# EAGLE schematic reg-board (EAGLE 7.6.0)

## Sheet 1 of 5: Bus Buffering
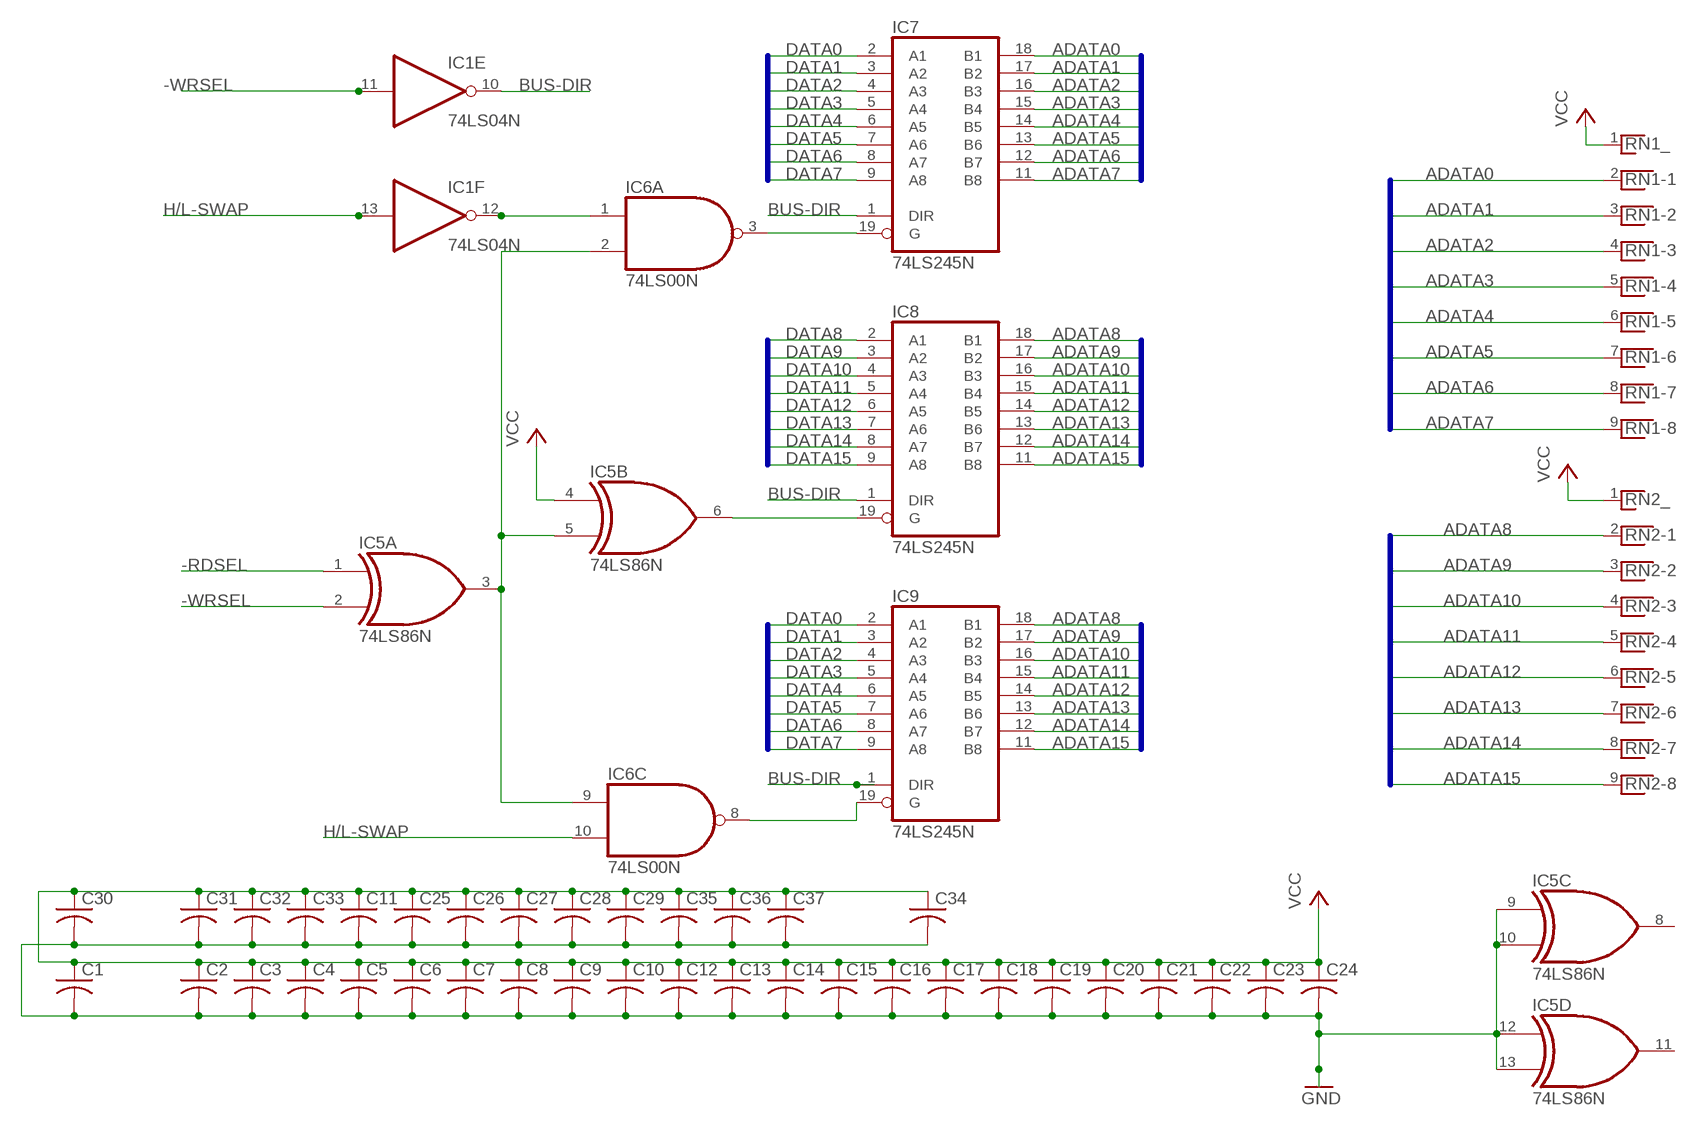
[diagram p0: schematic, sheet 1]

### Parts
C1  C-US025-040X050  [C025-040X050]
C2  C-US025-040X050  [C025-040X050]
C3  C-US025-040X050  [C025-040X050]
C4  C-US025-040X050  [C025-040X050]
C5  C-US025-040X050  [C025-040X050]
C6  C-US025-040X050  [C025-040X050]
C7  C-US025-040X050  [C025-040X050]
C8  C-US025-040X050  [C025-040X050]
C9  C-US025-040X050  [C025-040X050]
C10  C-US025-040X050  [C025-040X050]
C11  C-US025-040X050  [C025-040X050]
C12  C-US025-040X050  [C025-040X050]
C13  C-US025-040X050  [C025-040X050]
C14  C-US025-040X050  [C025-040X050]
C15  C-US025-040X050  [C025-040X050]
C16  C-US025-040X050  [C025-040X050]
C17  C-US025-040X050  [C025-040X050]
C18  C-US025-040X050  [C025-040X050]
C19  C-US025-040X050  [C025-040X050]
C20  C-US025-040X050  [C025-040X050]
C21  C-US025-040X050  [C025-040X050]
C22  C-US025-040X050  [C025-040X050]
C23  C-US025-040X050  [C025-040X050]
C24  C-US025-040X050  [C025-040X050]
C25  C-US025-040X050  [C025-040X050]
C26  C-US025-040X050  [C025-040X050]
C27  C-US025-040X050  [C025-040X050]
C28  C-US025-040X050  [C025-040X050]
C29  C-US025-040X050  [C025-040X050]
C30  C-US025-040X050  [C025-040X050]
C31  C-US025-040X050  [C025-040X050]
C32  C-US025-040X050  [C025-040X050]
C33  C-US025-040X050  [C025-040X050]
C34  C-US025-040X050  [C025-040X050]
C35  C-US025-040X050  [C025-040X050]
C36  C-US025-040X050  [C025-040X050]
C37  C-US025-040X050  [C025-040X050]
IC1  74LS04N  [DIL14]
IC5  74LS86N  [DIL14]
IC6  74LS00N  [DIL14]
IC7  74LS245N  [DIL20]
IC8  74LS245N  [DIL20]
IC9  74LS245N  [DIL20]
RN1  RNX8  [RN-9]
RN2  RNX8  [RN-9]

### Nets
-RDSEL: IC5.1(A:I0) ; also sheet 2
-WRSEL: IC1.11(E:I) IC5.2(A:I1) ; also sheet 2
ADATA0: IC7.18(B1) RN1.2 ; also sheet 2,3,4
ADATA1: IC7.17(B2) RN1.3 ; also sheet 2,3,4
ADATA2: IC7.16(B3) RN1.4 ; also sheet 2,3,4
ADATA3: IC7.15(B4) RN1.5 ; also sheet 2,3,4
ADATA4: IC7.14(B5) RN1.6 ; also sheet 2,3,4
ADATA5: IC7.13(B6) RN1.7 ; also sheet 2,3,4
ADATA6: IC7.12(B7) RN1.8 ; also sheet 2,3,4
ADATA7: IC7.11(B8) RN1.9 ; also sheet 2,3,4
ADATA8: IC8.18(B1) IC9.18(B1) RN2.2 ; also sheet 2,3,4
ADATA9: IC8.17(B2) IC9.17(B2) RN2.3 ; also sheet 2,3,4
ADATA10: IC8.16(B3) IC9.16(B3) RN2.4 ; also sheet 2,3,4
ADATA11: IC8.15(B4) IC9.15(B4) RN2.5 ; also sheet 2,3,4
ADATA12: IC8.14(B5) IC9.14(B5) RN2.6 ; also sheet 2,3,4
ADATA13: IC8.13(B6) IC9.13(B6) RN2.7 ; also sheet 2,3,4
ADATA14: IC8.12(B7) IC9.12(B7) RN2.8 ; also sheet 2,3,4
ADATA15: IC8.11(B8) IC9.11(B8) RN2.9 ; also sheet 2,3,4
BUS-DIR: IC1.10(E:O) IC7.1(DIR) IC8.1(DIR) IC9.1(DIR)
DATA0: IC7.2(A1) IC9.2(A1) ; also sheet 5
DATA1: IC7.3(A2) IC9.3(A2) ; also sheet 5
DATA2: IC7.4(A3) IC9.4(A3) ; also sheet 5
DATA3: IC7.5(A4) IC9.5(A4) ; also sheet 5
DATA4: IC7.6(A5) IC9.6(A5) ; also sheet 5
DATA5: IC7.7(A6) IC9.7(A6) ; also sheet 5
DATA6: IC7.8(A7) IC9.8(A7) ; also sheet 5
DATA7: IC7.9(A8) IC9.9(A8) ; also sheet 5
DATA8: IC8.2(A1) ; also sheet 5
DATA9: IC8.3(A2) ; also sheet 5
DATA10: IC8.4(A3) ; also sheet 5
DATA11: IC8.5(A4) ; also sheet 5
DATA12: IC8.6(A5) ; also sheet 5
DATA13: IC8.7(A6) ; also sheet 5
DATA14: IC8.8(A7) ; also sheet 5
DATA15: IC8.9(A8) ; also sheet 5
GND: C1.2 C2.2 C3.2 C4.2 C5.2 C6.2 C7.2 C8.2 C9.2 C10.2 C11.2 C12.2 C13.2 C14.2 C15.2 C16.2 C17.2 C18.2 C19.2 C20.2 C21.2 C22.2 C23.2 C24.2 C25.2 C26.2 C27.2 C28.2 C29.2 C30.2 C31.2 C32.2 C33.2 C34.2 C35.2 C36.2 C37.2 IC5.9(C:I0) IC5.10(C:I1) IC5.12(D:I0) IC5.13(D:I1) ; also sheet 4,5
H/L-SWAP: IC1.13(F:I) IC6.10(C:I1) ; also sheet 5
N$37: IC6.8(C:O) IC9.19(G)
N$38: IC6.3(A:O) IC7.19(G)
N$39: IC5.6(B:O) IC8.19(G)
N$40: IC5.3(A:O) IC5.5(B:I1) IC6.2(A:I1) IC6.9(C:I0)
N$41: IC1.12(F:O) IC6.1(A:I0)
VCC: C1.1 C2.1 C3.1 C4.1 C5.1 C6.1 C7.1 C8.1 C9.1 C10.1 C11.1 C12.1 C13.1 C14.1 C15.1 C16.1 C17.1 C18.1 C19.1 C20.1 C21.1 C22.1 C23.1 C24.1 C25.1 C26.1 C27.1 C28.1 C29.1 C30.1 C31.1 C32.1 C33.1 C34.1 C35.1 C36.1 C37.1 IC5.4(B:I0) RN1.1 RN2.1 ; also sheet 2,4,5
Unconnected: IC5.8(C:O) IC5.11(D:O)

### Buses
DATA[8..15]
DATA[0..7]
ADATA[0..7]
ADATA[8..15]

## Sheet 2 of 5: REGISTER FILE 1/2
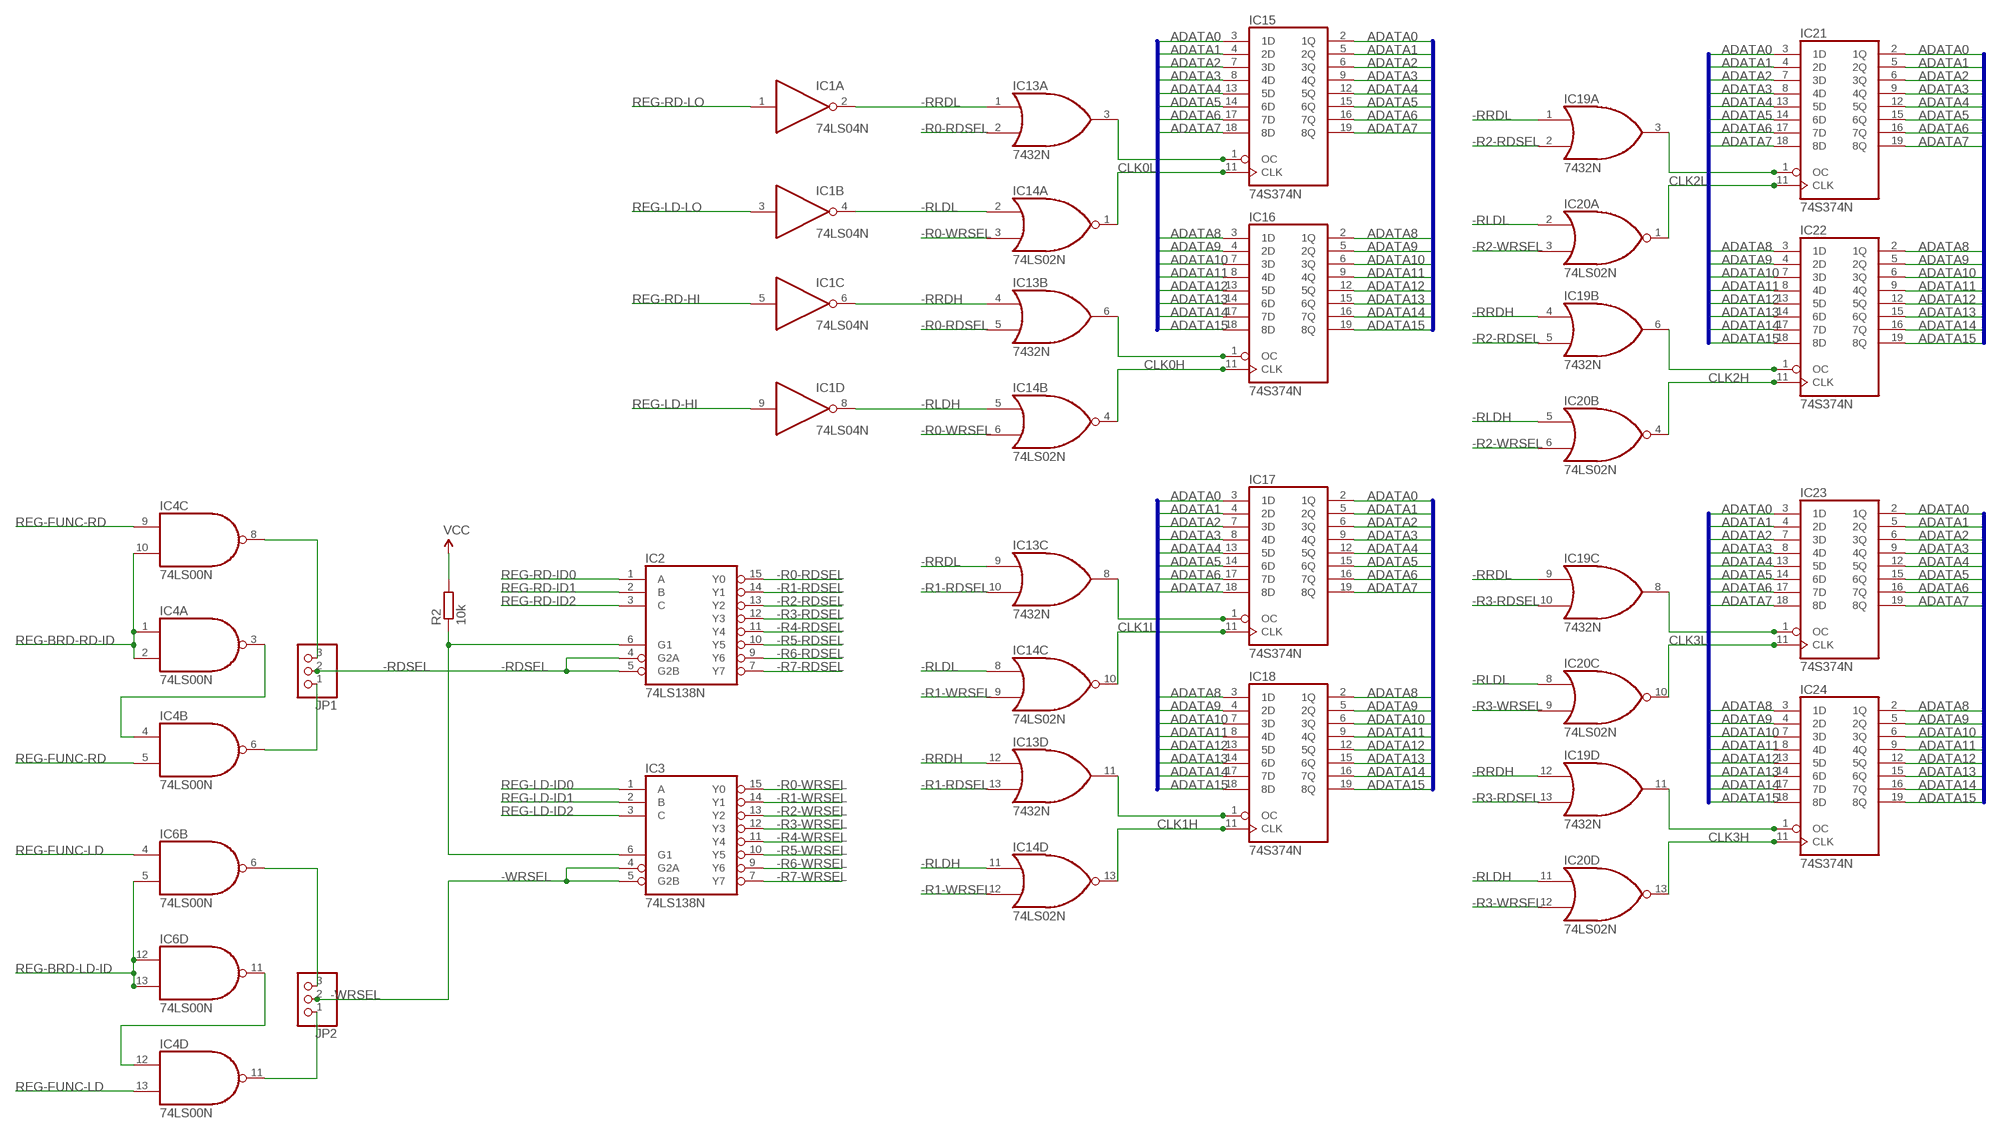
[diagram p1: schematic, sheet 2]

### Parts
IC2  74LS138N  [DIL16]
IC3  74LS138N  [DIL16]
IC4  74LS00N  [DIL14]
IC13  7432N  [DIL14]
IC14  74LS02N  [DIL14]
IC15  74S374N  [DIL20]
IC16  74S374N  [DIL20]
IC17  74S374N  [DIL20]
IC18  74S374N  [DIL20]
IC19  7432N  [DIL14]
IC20  74LS02N  [DIL14]
IC21  74S374N  [DIL20]
IC22  74S374N  [DIL20]
IC23  74S374N  [DIL20]
IC24  74S374N  [DIL20]
JP1  PINHD-1X3  [1X03]
JP2  PINHD-1X3  [1X03]
R2  10k  R0207/10  [0207/10]

### Nets
-R0-RDSEL: IC2.15(Y0) IC13.2(A:I1) IC13.5(B:I1)
-R0-WRSEL: IC3.15(Y0) IC14.3(A:I1) IC14.6(B:I1)
-R1-RDSEL: IC2.14(Y1) IC13.10(C:I1) IC13.13(D:I1)
-R1-WRSEL: IC3.14(Y1) IC14.9(C:I1) IC14.12(D:I1)
-R2-RDSEL: IC2.13(Y2) IC19.2(A:I1) IC19.5(B:I1)
-R2-WRSEL: IC3.13(Y2) IC20.3(A:I1) IC20.6(B:I1)
-R3-RDSEL: IC2.12(Y3) IC19.10(C:I1) IC19.13(D:I1)
-R3-WRSEL: IC3.12(Y3) IC20.9(C:I1) IC20.12(D:I1)
-R4-RDSEL: IC2.11(Y4) ; also sheet 3
-R4-WRSEL: IC3.11(Y4) ; also sheet 3
-R5-RDSEL: IC2.10(Y5) ; also sheet 3
-R5-WRSEL: IC3.10(Y5) ; also sheet 3
-R6-RDSEL: IC2.9(Y6) ; also sheet 3
-R6-WRSEL: IC3.9(Y6) ; also sheet 3
-R7-RDSEL: IC2.7(Y7) ; also sheet 3
-R7-WRSEL: IC3.7(Y7) ; also sheet 3
-RDSEL: IC2.4(G2A) IC2.5(G2B) JP1.2 ; also sheet 1
-RLDH: IC1.8(D:O) IC14.5(B:I0) IC14.11(D:I0) IC20.5(B:I0) IC20.11(D:I0) ; also sheet 3
-RLDL: IC1.4(B:O) IC14.2(A:I0) IC14.8(C:I0) IC20.2(A:I0) IC20.8(C:I0) ; also sheet 3
-RRDH: IC1.6(C:O) IC13.4(B:I0) IC13.12(D:I0) IC19.4(B:I0) IC19.12(D:I0) ; also sheet 3
-RRDL: IC1.2(A:O) IC13.1(A:I0) IC13.9(C:I0) IC19.1(A:I0) IC19.9(C:I0) ; also sheet 3
-WRSEL: IC3.4(G2A) IC3.5(G2B) JP2.2 ; also sheet 1
ADATA0: IC15.2(1Q) IC15.3(1D) IC17.2(1Q) IC17.3(1D) IC21.2(1Q) IC21.3(1D) IC23.2(1Q) IC23.3(1D) ; also sheet 1,3,4
ADATA1: IC15.4(2D) IC15.5(2Q) IC17.4(2D) IC17.5(2Q) IC21.4(2D) IC21.5(2Q) IC23.4(2D) IC23.5(2Q) ; also sheet 1,3,4
ADATA2: IC15.6(3Q) IC15.7(3D) IC17.6(3Q) IC17.7(3D) IC21.6(3Q) IC21.7(3D) IC23.6(3Q) IC23.7(3D) ; also sheet 1,3,4
ADATA3: IC15.8(4D) IC15.9(4Q) IC17.8(4D) IC17.9(4Q) IC21.8(4D) IC21.9(4Q) IC23.8(4D) IC23.9(4Q) ; also sheet 1,3,4
ADATA4: IC15.12(5Q) IC15.13(5D) IC17.12(5Q) IC17.13(5D) IC21.12(5Q) IC21.13(5D) IC23.12(5Q) IC23.13(5D) ; also sheet 1,3,4
ADATA5: IC15.14(6D) IC15.15(6Q) IC17.14(6D) IC17.15(6Q) IC21.14(6D) IC21.15(6Q) IC23.14(6D) IC23.15(6Q) ; also sheet 1,3,4
ADATA6: IC15.16(7Q) IC15.17(7D) IC17.16(7Q) IC17.17(7D) IC21.16(7Q) IC21.17(7D) IC23.16(7Q) IC23.17(7D) ; also sheet 1,3,4
ADATA7: IC15.18(8D) IC15.19(8Q) IC17.18(8D) IC17.19(8Q) IC21.18(8D) IC21.19(8Q) IC23.18(8D) IC23.19(8Q) ; also sheet 1,3,4
ADATA8: IC16.2(1Q) IC16.3(1D) IC18.2(1Q) IC18.3(1D) IC22.2(1Q) IC22.3(1D) IC24.2(1Q) IC24.3(1D) ; also sheet 1,3,4
ADATA9: IC16.4(2D) IC16.5(2Q) IC18.4(2D) IC18.5(2Q) IC22.4(2D) IC22.5(2Q) IC24.4(2D) IC24.5(2Q) ; also sheet 1,3,4
ADATA10: IC16.6(3Q) IC16.7(3D) IC18.6(3Q) IC18.7(3D) IC22.6(3Q) IC22.7(3D) IC24.6(3Q) IC24.7(3D) ; also sheet 1,3,4
ADATA11: IC16.8(4D) IC16.9(4Q) IC18.8(4D) IC18.9(4Q) IC22.8(4D) IC22.9(4Q) IC24.8(4D) IC24.9(4Q) ; also sheet 1,3,4
ADATA12: IC16.12(5Q) IC16.13(5D) IC18.12(5Q) IC18.13(5D) IC22.12(5Q) IC22.13(5D) IC24.12(5Q) IC24.13(5D) ; also sheet 1,3,4
ADATA13: IC16.14(6D) IC16.15(6Q) IC18.14(6D) IC18.15(6Q) IC22.14(6D) IC22.15(6Q) IC24.14(6D) IC24.15(6Q) ; also sheet 1,3,4
ADATA14: IC16.16(7Q) IC16.17(7D) IC18.16(7Q) IC18.17(7D) IC22.16(7Q) IC22.17(7D) IC24.16(7Q) IC24.17(7D) ; also sheet 1,3,4
ADATA15: IC16.18(8D) IC16.19(8Q) IC18.18(8D) IC18.19(8Q) IC22.18(8D) IC22.19(8Q) IC24.18(8D) IC24.19(8Q) ; also sheet 1,3,4
CLK0H: IC14.4(B:O) IC16.11(CLK) ; also sheet 4
CLK0L: IC14.1(A:O) IC15.11(CLK) ; also sheet 4
CLK1H: IC14.13(D:O) IC18.11(CLK) ; also sheet 4
CLK1L: IC14.10(C:O) IC17.11(CLK) ; also sheet 4
CLK2H: IC20.4(B:O) IC22.11(CLK) ; also sheet 4
CLK2L: IC20.1(A:O) IC21.11(CLK) ; also sheet 4
CLK3H: IC20.13(D:O) IC24.11(CLK) ; also sheet 4
CLK3L: IC20.10(C:O) IC23.11(CLK) ; also sheet 4
N$1: IC13.3(A:O) IC15.1(OC)
N$2: IC4.8(C:O) JP1.3
N$3: IC4.3(A:O) IC4.4(B:I0)
N$4: IC4.6(B:O) JP1.1
N$5: IC4.12(D:I0) IC6.11(D:O)
N$6: IC6.6(B:O) JP2.3
N$7: IC4.11(D:O) JP2.1
N$12: IC13.8(C:O) IC17.1(OC)
N$15: IC19.3(A:O) IC21.1(OC)
N$16: IC2.6(G1) IC3.6(G1) R2.1
N$17: IC19.8(C:O) IC23.1(OC)
N$19: IC13.11(D:O) IC18.1(OC)
N$21: IC19.11(D:O) IC24.1(OC)
N$23: IC19.6(B:O) IC22.1(OC)
N$25: IC13.6(B:O) IC16.1(OC)
REG-BRD-LD-ID: IC6.5(B:I1) IC6.12(D:I0) IC6.13(D:I1) ; also sheet 5
REG-BRD-RD-ID: IC4.1(A:I0) IC4.2(A:I1) IC4.10(C:I1) ; also sheet 5
REG-FUNC-LD: IC4.13(D:I1) IC6.4(B:I0) ; also sheet 5
REG-FUNC-RD: IC4.5(B:I1) IC4.9(C:I0) ; also sheet 5
REG-LD-HI: IC1.9(D:I) ; also sheet 5
REG-LD-ID0: IC3.1(A) ; also sheet 5
REG-LD-ID1: IC3.2(B) ; also sheet 5
REG-LD-ID2: IC3.3(C) ; also sheet 5
REG-LD-LO: IC1.3(B:I) ; also sheet 5
REG-RD-HI: IC1.5(C:I) ; also sheet 5
REG-RD-ID0: IC2.1(A) ; also sheet 5
REG-RD-ID1: IC2.2(B) ; also sheet 5
REG-RD-ID2: IC2.3(C) ; also sheet 5
REG-RD-LO: IC1.1(A:I) ; also sheet 5
VCC: R2.2 ; also sheet 1,4,5

### Buses
ADATA[0..15]

## Sheet 3 of 5: REGISTER FILE 2/2
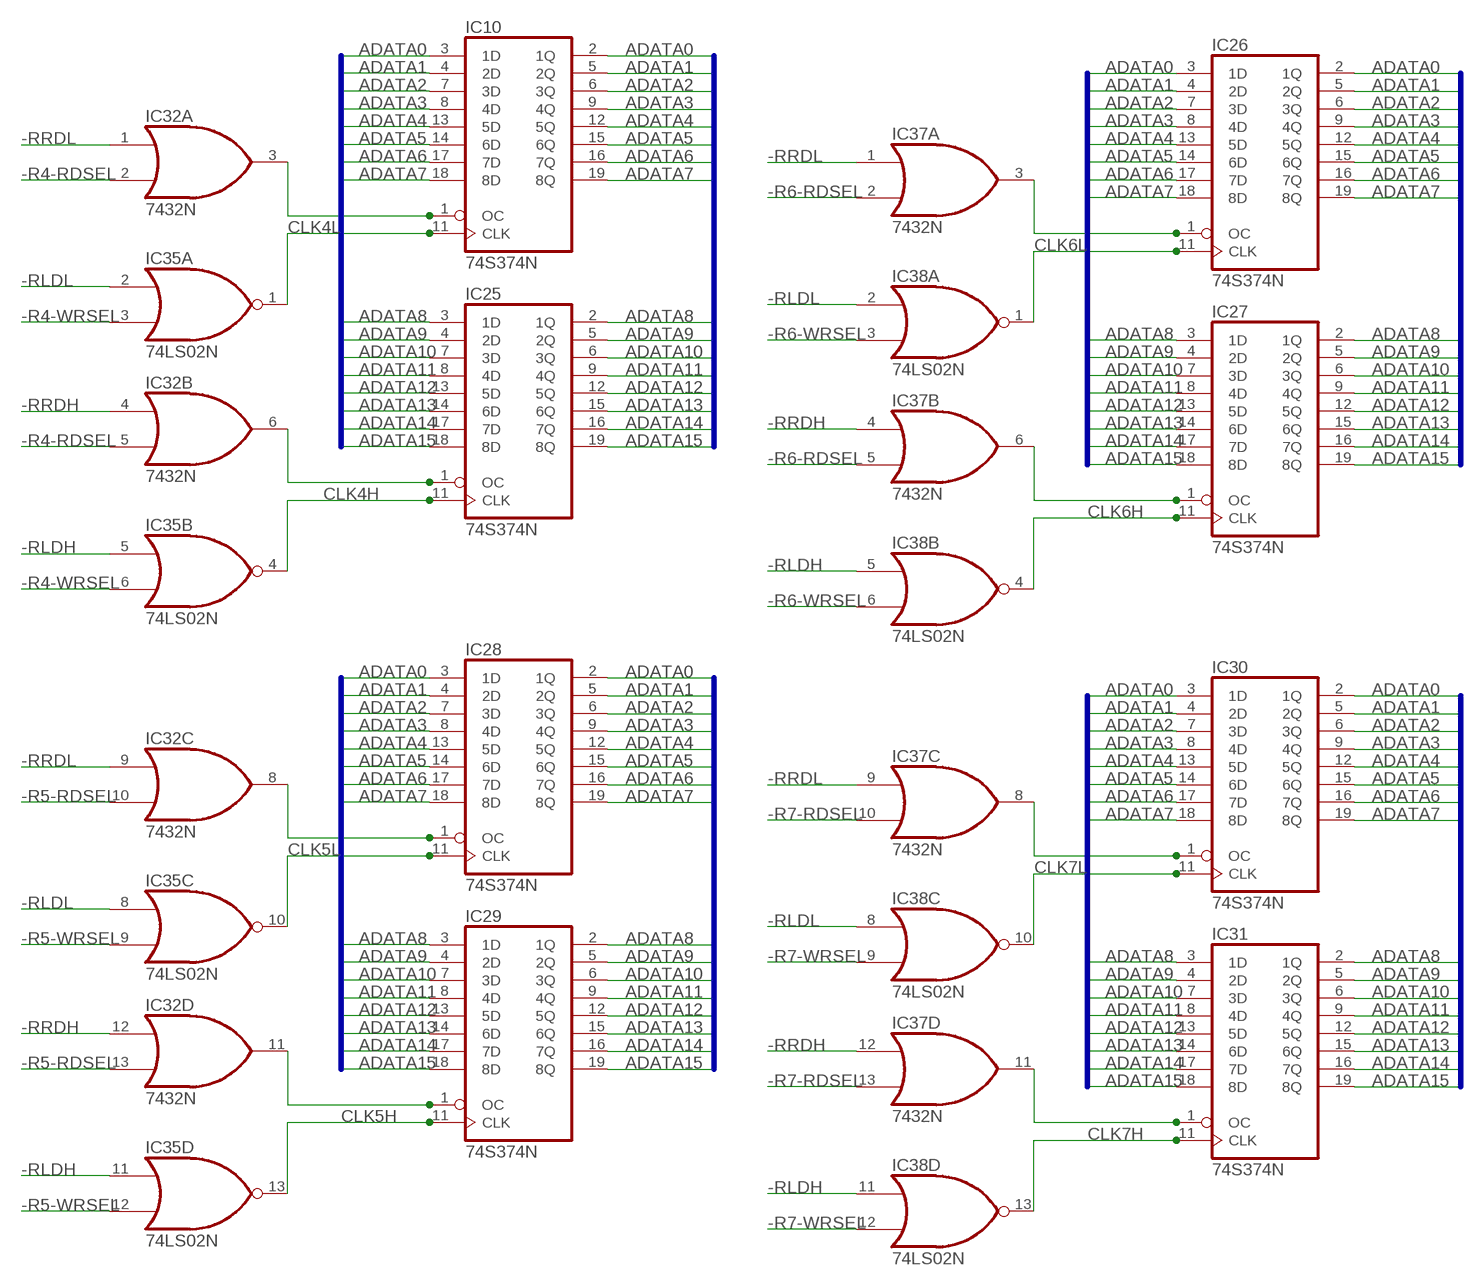
[diagram p2: schematic, sheet 3]

### Parts
IC10  74S374N  [DIL20]
IC25  74S374N  [DIL20]
IC26  74S374N  [DIL20]
IC27  74S374N  [DIL20]
IC28  74S374N  [DIL20]
IC29  74S374N  [DIL20]
IC30  74S374N  [DIL20]
IC31  74S374N  [DIL20]
IC32  7432N  [DIL14]
IC35  74LS02N  [DIL14]
IC37  7432N  [DIL14]
IC38  74LS02N  [DIL14]

### Nets
-R4-RDSEL: IC32.2(A:I1) IC32.5(B:I1) ; also sheet 2
-R4-WRSEL: IC35.3(A:I1) IC35.6(B:I1) ; also sheet 2
-R5-RDSEL: IC32.10(C:I1) IC32.13(D:I1) ; also sheet 2
-R5-WRSEL: IC35.9(C:I1) IC35.12(D:I1) ; also sheet 2
-R6-RDSEL: IC37.2(A:I1) IC37.5(B:I1) ; also sheet 2
-R6-WRSEL: IC38.3(A:I1) IC38.6(B:I1) ; also sheet 2
-R7-RDSEL: IC37.10(C:I1) IC37.13(D:I1) ; also sheet 2
-R7-WRSEL: IC38.9(C:I1) IC38.12(D:I1) ; also sheet 2
-RLDH: IC35.5(B:I0) IC35.11(D:I0) IC38.5(B:I0) IC38.11(D:I0) ; also sheet 2
-RLDL: IC35.2(A:I0) IC35.8(C:I0) IC38.2(A:I0) IC38.8(C:I0) ; also sheet 2
-RRDH: IC32.4(B:I0) IC32.12(D:I0) IC37.4(B:I0) IC37.12(D:I0) ; also sheet 2
-RRDL: IC32.1(A:I0) IC32.9(C:I0) IC37.1(A:I0) IC37.9(C:I0) ; also sheet 2
ADATA0: IC10.2(1Q) IC10.3(1D) IC26.2(1Q) IC26.3(1D) IC28.2(1Q) IC28.3(1D) IC30.2(1Q) IC30.3(1D) ; also sheet 1,2,4
ADATA1: IC10.4(2D) IC10.5(2Q) IC26.4(2D) IC26.5(2Q) IC28.4(2D) IC28.5(2Q) IC30.4(2D) IC30.5(2Q) ; also sheet 1,2,4
ADATA2: IC10.6(3Q) IC10.7(3D) IC26.6(3Q) IC26.7(3D) IC28.6(3Q) IC28.7(3D) IC30.6(3Q) IC30.7(3D) ; also sheet 1,2,4
ADATA3: IC10.8(4D) IC10.9(4Q) IC26.8(4D) IC26.9(4Q) IC28.8(4D) IC28.9(4Q) IC30.8(4D) IC30.9(4Q) ; also sheet 1,2,4
ADATA4: IC10.12(5Q) IC10.13(5D) IC26.12(5Q) IC26.13(5D) IC28.12(5Q) IC28.13(5D) IC30.12(5Q) IC30.13(5D) ; also sheet 1,2,4
ADATA5: IC10.14(6D) IC10.15(6Q) IC26.14(6D) IC26.15(6Q) IC28.14(6D) IC28.15(6Q) IC30.14(6D) IC30.15(6Q) ; also sheet 1,2,4
ADATA6: IC10.16(7Q) IC10.17(7D) IC26.16(7Q) IC26.17(7D) IC28.16(7Q) IC28.17(7D) IC30.16(7Q) IC30.17(7D) ; also sheet 1,2,4
ADATA7: IC10.18(8D) IC10.19(8Q) IC26.18(8D) IC26.19(8Q) IC28.18(8D) IC28.19(8Q) IC30.18(8D) IC30.19(8Q) ; also sheet 1,2,4
ADATA8: IC25.2(1Q) IC25.3(1D) IC27.2(1Q) IC27.3(1D) IC29.2(1Q) IC29.3(1D) IC31.2(1Q) IC31.3(1D) ; also sheet 1,2,4
ADATA9: IC25.4(2D) IC25.5(2Q) IC27.4(2D) IC27.5(2Q) IC29.4(2D) IC29.5(2Q) IC31.4(2D) IC31.5(2Q) ; also sheet 1,2,4
ADATA10: IC25.6(3Q) IC25.7(3D) IC27.6(3Q) IC27.7(3D) IC29.6(3Q) IC29.7(3D) IC31.6(3Q) IC31.7(3D) ; also sheet 1,2,4
ADATA11: IC25.8(4D) IC25.9(4Q) IC27.8(4D) IC27.9(4Q) IC29.8(4D) IC29.9(4Q) IC31.8(4D) IC31.9(4Q) ; also sheet 1,2,4
ADATA12: IC25.12(5Q) IC25.13(5D) IC27.12(5Q) IC27.13(5D) IC29.12(5Q) IC29.13(5D) IC31.12(5Q) IC31.13(5D) ; also sheet 1,2,4
ADATA13: IC25.14(6D) IC25.15(6Q) IC27.14(6D) IC27.15(6Q) IC29.14(6D) IC29.15(6Q) IC31.14(6D) IC31.15(6Q) ; also sheet 1,2,4
ADATA14: IC25.16(7Q) IC25.17(7D) IC27.16(7Q) IC27.17(7D) IC29.16(7Q) IC29.17(7D) IC31.16(7Q) IC31.17(7D) ; also sheet 1,2,4
ADATA15: IC25.18(8D) IC25.19(8Q) IC27.18(8D) IC27.19(8Q) IC29.18(8D) IC29.19(8Q) IC31.18(8D) IC31.19(8Q) ; also sheet 1,2,4
CLK4H: IC25.11(CLK) IC35.4(B:O) ; also sheet 4
CLK4L: IC10.11(CLK) IC35.1(A:O) ; also sheet 4
CLK5H: IC29.11(CLK) IC35.13(D:O) ; also sheet 4
CLK5L: IC28.11(CLK) IC35.10(C:O) ; also sheet 4
CLK6H: IC27.11(CLK) IC38.4(B:O) ; also sheet 4
CLK6L: IC26.11(CLK) IC38.1(A:O) ; also sheet 4
CLK7H: IC31.11(CLK) IC38.13(D:O) ; also sheet 4
CLK7L: IC30.11(CLK) IC38.10(C:O) ; also sheet 4
N$10: IC10.1(OC) IC32.3(A:O)
N$45: IC28.1(OC) IC32.8(C:O)
N$46: IC26.1(OC) IC37.3(A:O)
N$47: IC30.1(OC) IC37.8(C:O)
N$48: IC29.1(OC) IC32.11(D:O)
N$49: IC31.1(OC) IC37.11(D:O)
N$50: IC27.1(OC) IC37.6(B:O)
N$51: IC25.1(OC) IC32.6(B:O)

### Buses
ADATA[0..15]

## Sheet 4 of 5: FRONT PANEL CONNECTOR
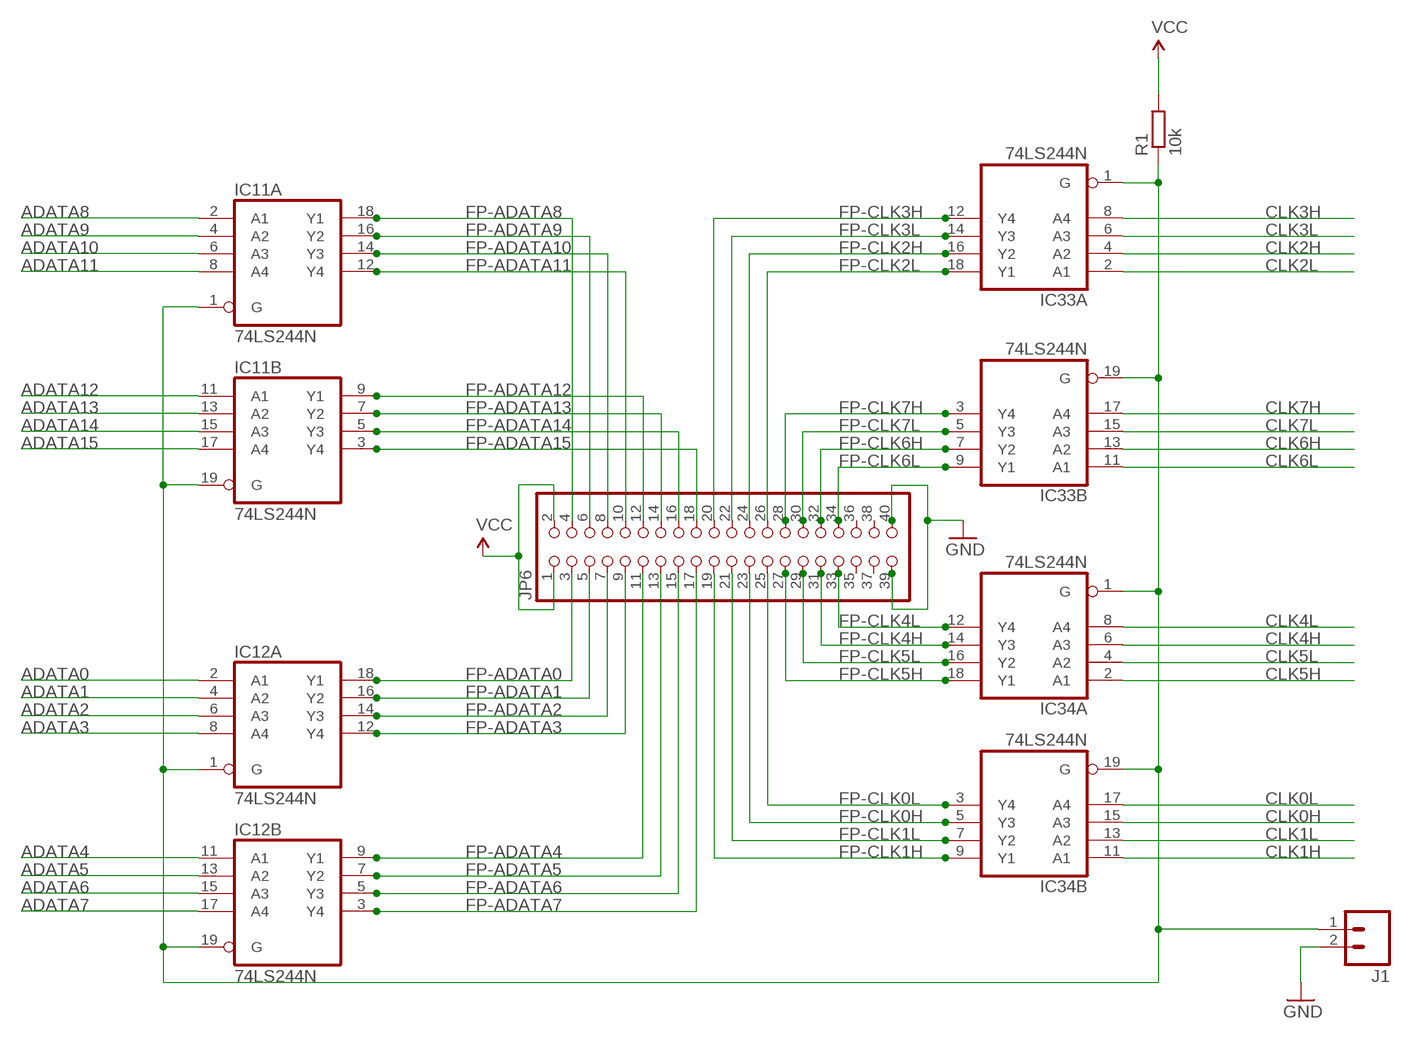
[diagram p3: schematic, sheet 4]

### Parts
IC11  74LS244N  [DIL20]
IC12  74LS244N  [DIL20]
IC33  74LS244N  [DIL20]
IC34  74LS244N  [DIL20]
J1  M02PTH  [1X02]
JP6  PINHD-2X20  [2X20]
R1  10k  R0207/10  [0207/10]

### Nets
ADATA0: IC12.2(A:A1) ; also sheet 1,2,3
ADATA1: IC12.4(A:A2) ; also sheet 1,2,3
ADATA2: IC12.6(A:A3) ; also sheet 1,2,3
ADATA3: IC12.8(A:A4) ; also sheet 1,2,3
ADATA4: IC12.11(B:A1) ; also sheet 1,2,3
ADATA5: IC12.13(B:A2) ; also sheet 1,2,3
ADATA6: IC12.15(B:A3) ; also sheet 1,2,3
ADATA7: IC12.17(B:A4) ; also sheet 1,2,3
ADATA8: IC11.2(A:A1) ; also sheet 1,2,3
ADATA9: IC11.4(A:A2) ; also sheet 1,2,3
ADATA10: IC11.6(A:A3) ; also sheet 1,2,3
ADATA11: IC11.8(A:A4) ; also sheet 1,2,3
ADATA12: IC11.11(B:A1) ; also sheet 1,2,3
ADATA13: IC11.13(B:A2) ; also sheet 1,2,3
ADATA14: IC11.15(B:A3) ; also sheet 1,2,3
ADATA15: IC11.17(B:A4) ; also sheet 1,2,3
CLK0H: IC34.15(B:A3) ; also sheet 2
CLK0L: IC34.17(B:A4) ; also sheet 2
CLK1H: IC34.11(B:A1) ; also sheet 2
CLK1L: IC34.13(B:A2) ; also sheet 2
CLK2H: IC33.4(A:A2) ; also sheet 2
CLK2L: IC33.2(A:A1) ; also sheet 2
CLK3H: IC33.8(A:A4) ; also sheet 2
CLK3L: IC33.6(A:A3) ; also sheet 2
CLK4H: IC34.6(A:A3) ; also sheet 3
CLK4L: IC34.8(A:A4) ; also sheet 3
CLK5H: IC34.2(A:A1) ; also sheet 3
CLK5L: IC34.4(A:A2) ; also sheet 3
CLK6H: IC33.13(B:A2) ; also sheet 3
CLK6L: IC33.11(B:A1) ; also sheet 3
CLK7H: IC33.17(B:A4) ; also sheet 3
CLK7L: IC33.15(B:A3) ; also sheet 3
FP-ADATA0: IC12.18(A:Y1) JP6.3
FP-ADATA1: IC12.16(A:Y2) JP6.5
FP-ADATA2: IC12.14(A:Y3) JP6.7
FP-ADATA3: IC12.12(A:Y4) JP6.9
FP-ADATA4: IC12.9(B:Y1) JP6.11
FP-ADATA5: IC12.7(B:Y2) JP6.13
FP-ADATA6: IC12.5(B:Y3) JP6.15
FP-ADATA7: IC12.3(B:Y4) JP6.17
FP-ADATA8: IC11.18(A:Y1) JP6.4
FP-ADATA9: IC11.16(A:Y2) JP6.6
FP-ADATA10: IC11.14(A:Y3) JP6.8
FP-ADATA11: IC11.12(A:Y4) JP6.10
FP-ADATA12: IC11.9(B:Y1) JP6.12
FP-ADATA13: IC11.7(B:Y2) JP6.14
FP-ADATA14: IC11.5(B:Y3) JP6.16
FP-ADATA15: IC11.3(B:Y4) JP6.18
FP-CLK0H: IC34.5(B:Y3) JP6.23
FP-CLK0L: IC34.3(B:Y4) JP6.25
FP-CLK1H: IC34.9(B:Y1) JP6.19
FP-CLK1L: IC34.7(B:Y2) JP6.21
FP-CLK2H: IC33.16(A:Y2) JP6.24
FP-CLK2L: IC33.18(A:Y1) JP6.26
FP-CLK3H: IC33.12(A:Y4) JP6.20
FP-CLK3L: IC33.14(A:Y3) JP6.22
FP-CLK4H: IC34.14(A:Y3) JP6.31
FP-CLK4L: IC34.12(A:Y4) JP6.33
FP-CLK5H: IC34.18(A:Y1) JP6.27
FP-CLK5L: IC34.16(A:Y2) JP6.29
FP-CLK6H: IC33.7(B:Y2) JP6.32
FP-CLK6L: IC33.9(B:Y1) JP6.34
FP-CLK7H: IC33.3(B:Y4) JP6.28
FP-CLK7L: IC33.5(B:Y3) JP6.30
GND: J1.2 JP6.39 JP6.40 ; also sheet 1,5
N$8: IC11.1(A:G) IC11.19(B:G) IC12.1(A:G) IC12.19(B:G) IC33.1(A:G) IC33.19(B:G) IC34.1(A:G) IC34.19(B:G) J1.1 R1.1
VCC: JP6.1 JP6.2 R1.2 ; also sheet 1,2,5
Unconnected: JP6.35 JP6.36 JP6.37 JP6.38

## Sheet 5 of 5: BUS
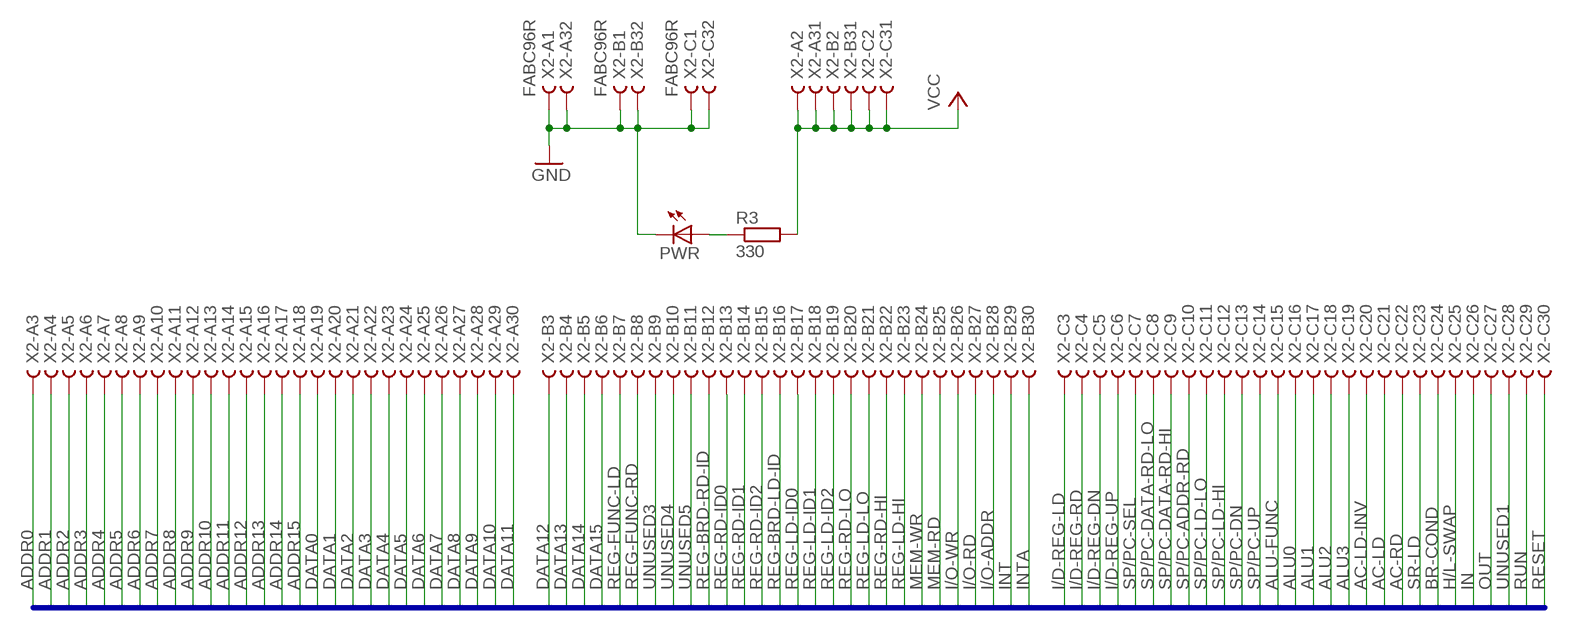
[diagram p4: schematic, sheet 5]

### Parts
PWR  LED5MM  [LED5MM]
R3  330  R0207/10  [0207/10]
X2  FABC96R  [FABC96R]

### Nets
AC-LD: X2.C21
AC-LD-INV: X2.C20
AC-RD: X2.C22
ADDR0: X2.A3
ADDR1: X2.A4
ADDR2: X2.A5
ADDR3: X2.A6
ADDR4: X2.A7
ADDR5: X2.A8
ADDR6: X2.A9
ADDR7: X2.A10
ADDR8: X2.A11
ADDR9: X2.A12
ADDR10: X2.A13
ADDR11: X2.A14
ADDR12: X2.A15
ADDR13: X2.A16
ADDR14: X2.A17
ADDR15: X2.A18
ALU0: X2.C16
ALU1: X2.C17
ALU2: X2.C18
ALU3: X2.C19
ALU-FUNC: X2.C15
BR-COND: X2.C24
DATA0: X2.A19 ; also sheet 1
DATA1: X2.A20 ; also sheet 1
DATA2: X2.A21 ; also sheet 1
DATA3: X2.A22 ; also sheet 1
DATA4: X2.A23 ; also sheet 1
DATA5: X2.A24 ; also sheet 1
DATA6: X2.A25 ; also sheet 1
DATA7: X2.A26 ; also sheet 1
DATA8: X2.A27 ; also sheet 1
DATA9: X2.A28 ; also sheet 1
DATA10: X2.A29 ; also sheet 1
DATA11: X2.A30 ; also sheet 1
DATA12: X2.B3 ; also sheet 1
DATA13: X2.B4 ; also sheet 1
DATA14: X2.B5 ; also sheet 1
DATA15: X2.B6 ; also sheet 1
GND: PWR.K(C) X2.A1 X2.A32 X2.B1 X2.B32 X2.C1 X2.C32 ; also sheet 1,4
H/L-SWAP: X2.C25 ; also sheet 1
I/D-REG-DN: X2.C5
I/D-REG-LD: X2.C3
I/D-REG-RD: X2.C4
I/D-REG-UP: X2.C6
I/O-ADDR: X2.B28
I/O-RD: X2.B27
I/O-WR: X2.B26
IN: X2.C26
INT: X2.B29
INTA: X2.B30
MEM-RD: X2.B25
MEM-WR: X2.B24
N$9: PWR.A R3.1
OUT: X2.C27
REG-BRD-LD-ID: X2.B16 ; also sheet 2
REG-BRD-RD-ID: X2.B12 ; also sheet 2
REG-FUNC-LD: X2.B7 ; also sheet 2
REG-FUNC-RD: X2.B8 ; also sheet 2
REG-LD-HI: X2.B23 ; also sheet 2
REG-LD-ID0: X2.B17 ; also sheet 2
REG-LD-ID1: X2.B18 ; also sheet 2
REG-LD-ID2: X2.B19 ; also sheet 2
REG-LD-LO: X2.B21 ; also sheet 2
REG-RD-HI: X2.B22 ; also sheet 2
REG-RD-ID0: X2.B13 ; also sheet 2
REG-RD-ID1: X2.B14 ; also sheet 2
REG-RD-ID2: X2.B15 ; also sheet 2
REG-RD-LO: X2.B20 ; also sheet 2
RESET: X2.C30
RUN: X2.C29
SP/PC-ADDR-RD: X2.C10
SP/PC-DATA-RD-HI: X2.C9
SP/PC-DATA-RD-LO: X2.C8
SP/PC-DN: X2.C13
SP/PC-LD-HI: X2.C12
SP/PC-LD-LO: X2.C11
SP/PC-SEL: X2.C7
SP/PC-UP: X2.C14
SR-LD: X2.C23
UNUSED1: X2.C28
UNUSED3: X2.B9
UNUSED4: X2.B10
UNUSED5: X2.B11
VCC: R3.2 X2.A2 X2.A31 X2.B2 X2.B31 X2.C2 X2.C31 ; also sheet 1,2,4

### Buses
ADDR[0..15],DATA[0..15],REG-FUNC,REG-BRD-RD-ID,REG-RD-ID[0..2],REG-BRD-LD-ID,REG-LD-ID[0..2],REG-RD-LO,REG-LD-LO,REG-RD-HI,REG-LD-HI,MEM-WR,MEM-RD,I/O-WR,I/O-RD,I/O-ADDR,INT,INTA,I/D-REG-LD,I/D-REG-RD,I/D-REG-DN,I/D-REG-UP,SP/PC-SEL,SP/PC-DATA-RD-LO,SP/PC-DATA-RD-HI,SP/PC-ADDR-RD,SP/PC-LD-LO,SP/PC-LD-HI,SP/PC-DN,SP/PC-UP,ALU-FUNC,ALU[0..3],AC-LD-INV,AC-LD,AC-RD,SR-LD,BR-COND,H/L-SWAP,IN,OUT,UNUSED[1..5],RESET,RUN

## Power pins joined to a net without a drawn wire
GND: IC1.7(P:GND) IC2.8(GND) IC3.8(GND) IC4.7(P:GND) IC5.7(P:GND) IC6.7(P:GND) IC7.10(GND) IC8.10(GND) IC9.10(GND) IC10.10(GND) IC11.10(P:GND) IC12.10(P:GND) IC13.7(P:GND) IC14.7(P:GND) IC15.10(GND) IC16.10(GND) IC17.10(GND) IC18.10(GND) IC19.7(P:GND) IC20.7(P:GND) IC21.10(GND) IC22.10(GND) IC23.10(GND) IC24.10(GND) IC25.10(GND) IC26.10(GND) IC27.10(GND) IC28.10(GND) IC29.10(GND) IC30.10(GND) IC31.10(GND) IC32.7(P:GND) IC33.10(P:GND) IC34.10(P:GND) IC35.7(P:GND) IC37.7(P:GND) IC38.7(P:GND)
VCC: IC1.14(P:VCC) IC2.16(VCC) IC3.16(VCC) IC4.14(P:VCC) IC5.14(P:VCC) IC6.14(P:VCC) IC7.20(VCC) IC8.20(VCC) IC9.20(VCC) IC10.20(VCC) IC11.20(P:VCC) IC12.20(P:VCC) IC13.14(P:VCC) IC14.14(P:VCC) IC15.20(VCC) IC16.20(VCC) IC17.20(VCC) IC18.20(VCC) IC19.14(P:VCC) IC20.14(P:VCC) IC21.20(VCC) IC22.20(VCC) IC23.20(VCC) IC24.20(VCC) IC25.20(VCC) IC26.20(VCC) IC27.20(VCC) IC28.20(VCC) IC29.20(VCC) IC30.20(VCC) IC31.20(VCC) IC32.14(P:VCC) IC33.20(P:VCC) IC34.20(P:VCC) IC35.14(P:VCC) IC37.14(P:VCC) IC38.14(P:VCC)

## Library data of the parts
C1-C37 = rcl:C-US: CAPACITOR, American symbol
IC1 = 74xx-us:74*04: Hex INVERTER
IC2 IC3 = 74xx-us:74*138: 3-line to 8-line DECODER/DEMULTIPLEXER
IC4 IC6 = 74xx-us:74*00: Quad 2-input NAND gate
IC5 = 74xx-us:74*86: Quad 2-input EXCLUSIV-OR (XOR) gate
IC7-IC9 = 74xx-us:74*245: Octal BUS TRANSCEIVER, 3-state
IC10 IC15-IC18 IC21-IC31 = 74xx-us:74*374: Octal D type transparent LATCH, edge triggered
IC11 IC12 IC33 IC34 = 74xx-us:74*244: Octal BUFFER and LINE DRIVER, 3-state
IC13 IC19 IC32 IC37 = 74xx-us:74*32: Quad 2-input OR gate
IC14 IC20 IC35 IC38 = 74xx-us:74*02: Quad 2-input NOR gate
J1 = SparkFun-Connectors:M02: Standard 2-pin 0.1" header. Use with - straight break away headers ( PRT-00116) - right angle break away headers (PRT-00553) - swiss pins (PRT-00743) - machine pins (PRT-00117) - female headers (PRT-00115) Molex polarized connector foot print use with: PRT-08233 with associated crimp pins and housings. 2.54_SCREWTERM for use with PRT-10571. 3.5mm Screw Terminal footprints for PRT-08084 5mm Screw Terminal footprints for use with PRT-08432
JP1 JP2 = pinhead:PINHD-1X3: PIN HEADER
JP6 = pinhead:PINHD-2X20: PIN HEADER
PWR = led:LED: LED OSRAM: - CHIPLED LG R971, LG N971, LY N971, LG Q971, LY Q971, LO R971, LY R971 LH N974, LH R974 LS Q976, LO Q976, LY Q976 LO Q996 - Hyper CHIPLED LW Q18S LB Q993, LB Q99A, LB R99A - SideLED LS A670, LO A670, LY A670, LG A670, LP A670 LB A673, LV A673, LT A673, LW A673 LH A674 LY A675 LS A676, LA A676, LO A676, LY A676, LW A676 LS A679, LY A679, LG A679 - Hyper Micro SIDELED® LS Y876, LA Y876, LO Y876, LY Y876 LT Y87S - SmartLED LW L88C, LW L88S LB L89C, LB L89S, LG L890 LS L89K, LO L89K, LY L89K LS L896, LA L896, LO L896, LY L896 - TOPLED LS T670, LO T670, LY T670, LG T670, LP T670 LSG T670, LSP T670, LSY T670, LOP T670, LYG T670 LG T671, LOG T671, LSG T671 LB T673, LV T673, LT T673, LW T673 LH T674 LS T676, LA T676, LO T676, LY T676, LB T676, LH T676, LSB T676, LW T676 LB T67C, LV T67C, LT T67C, LS T67K, LO T67K, LY T67K, LW E67C LS E67B, LA E67B, LO E67B, LY E67B, LB E67C, LV E67C, LT E67C LW T67C LS T679, LY T679, LG T679 LS T770, LO T770, LY T770, LG T770, LP T770 LB T773, LV T773, LT T773, LW T773 LH T774 LS E675, LA E675, LY E675, LS T675 LS T776, LA T776, LO T776, LY T776, LB T776 LHGB T686 LT T68C, LB T68C - Hyper Mini TOPLED® LB M676 - Mini TOPLED Santana® LG M470 LS M47K, LO M47K, LY M47K Source: http://www.osram.convergy.de LUXEON: - LUMILED® LXK2-PW12-R00, LXK2-PW12-S00, LXK2-PW14-U00, LXK2-PW14-V00 LXK2-PM12-R00, LXK2-PM12-S00, LXK2-PM14-U00 LXK2-PE12-Q00, LXK2-PE12-R00, LXK2-PE12-S00, LXK2-PE14-T00, LXK2-PE14-U00 LXK2-PB12-K00, LXK2-PB12-L00, LXK2-PB12-M00, LXK2-PB14-N00, LXK2-PB14-P00, LXK2-PB14-Q00 LXK2-PR12-L00, LXK2-PR12-M00, LXK2-PR14-Q00, LXK2-PR14-R00 LXK2-PD12-Q00, LXK2-PD12-R00, LXK2-PD12-S00 LXK2-PH12-R00, LXK2-PH12-S00 LXK2-PL12-P00, LXK2-PL12-Q00, LXK2-PL12-R00 Source: www.luxeon.com KINGBRIGHT: KA-3528ASYC Source: www.kingbright.com
R1-R3 = eagle-ltspice:R: RESISTOR, European symbol; SPICEMODEL: NONE; SPICEPREFIX: R
RN1 RN2 = resistor-net:RNX8: RESISTOR NETWORK; OC_FARNELL: unknown; OC_NEWARK: unknown
X2 = con-vg:FABC96R: CONNECTOR female, 96 pins, type R, rows ABC, grid 2.54 mm

## Net classes
1 GND: width 1 mm
2 5V: width 1 mm